# Altium schematic sheet LoRaSnow_big.SchDoc
size A3; Date: Date; CompanyName: HESSO; Engineer: Name; Address1: Route du Rawyl 47; Address2: 1950 Sion; Address3: Switzerland; ProjectName: Project Name
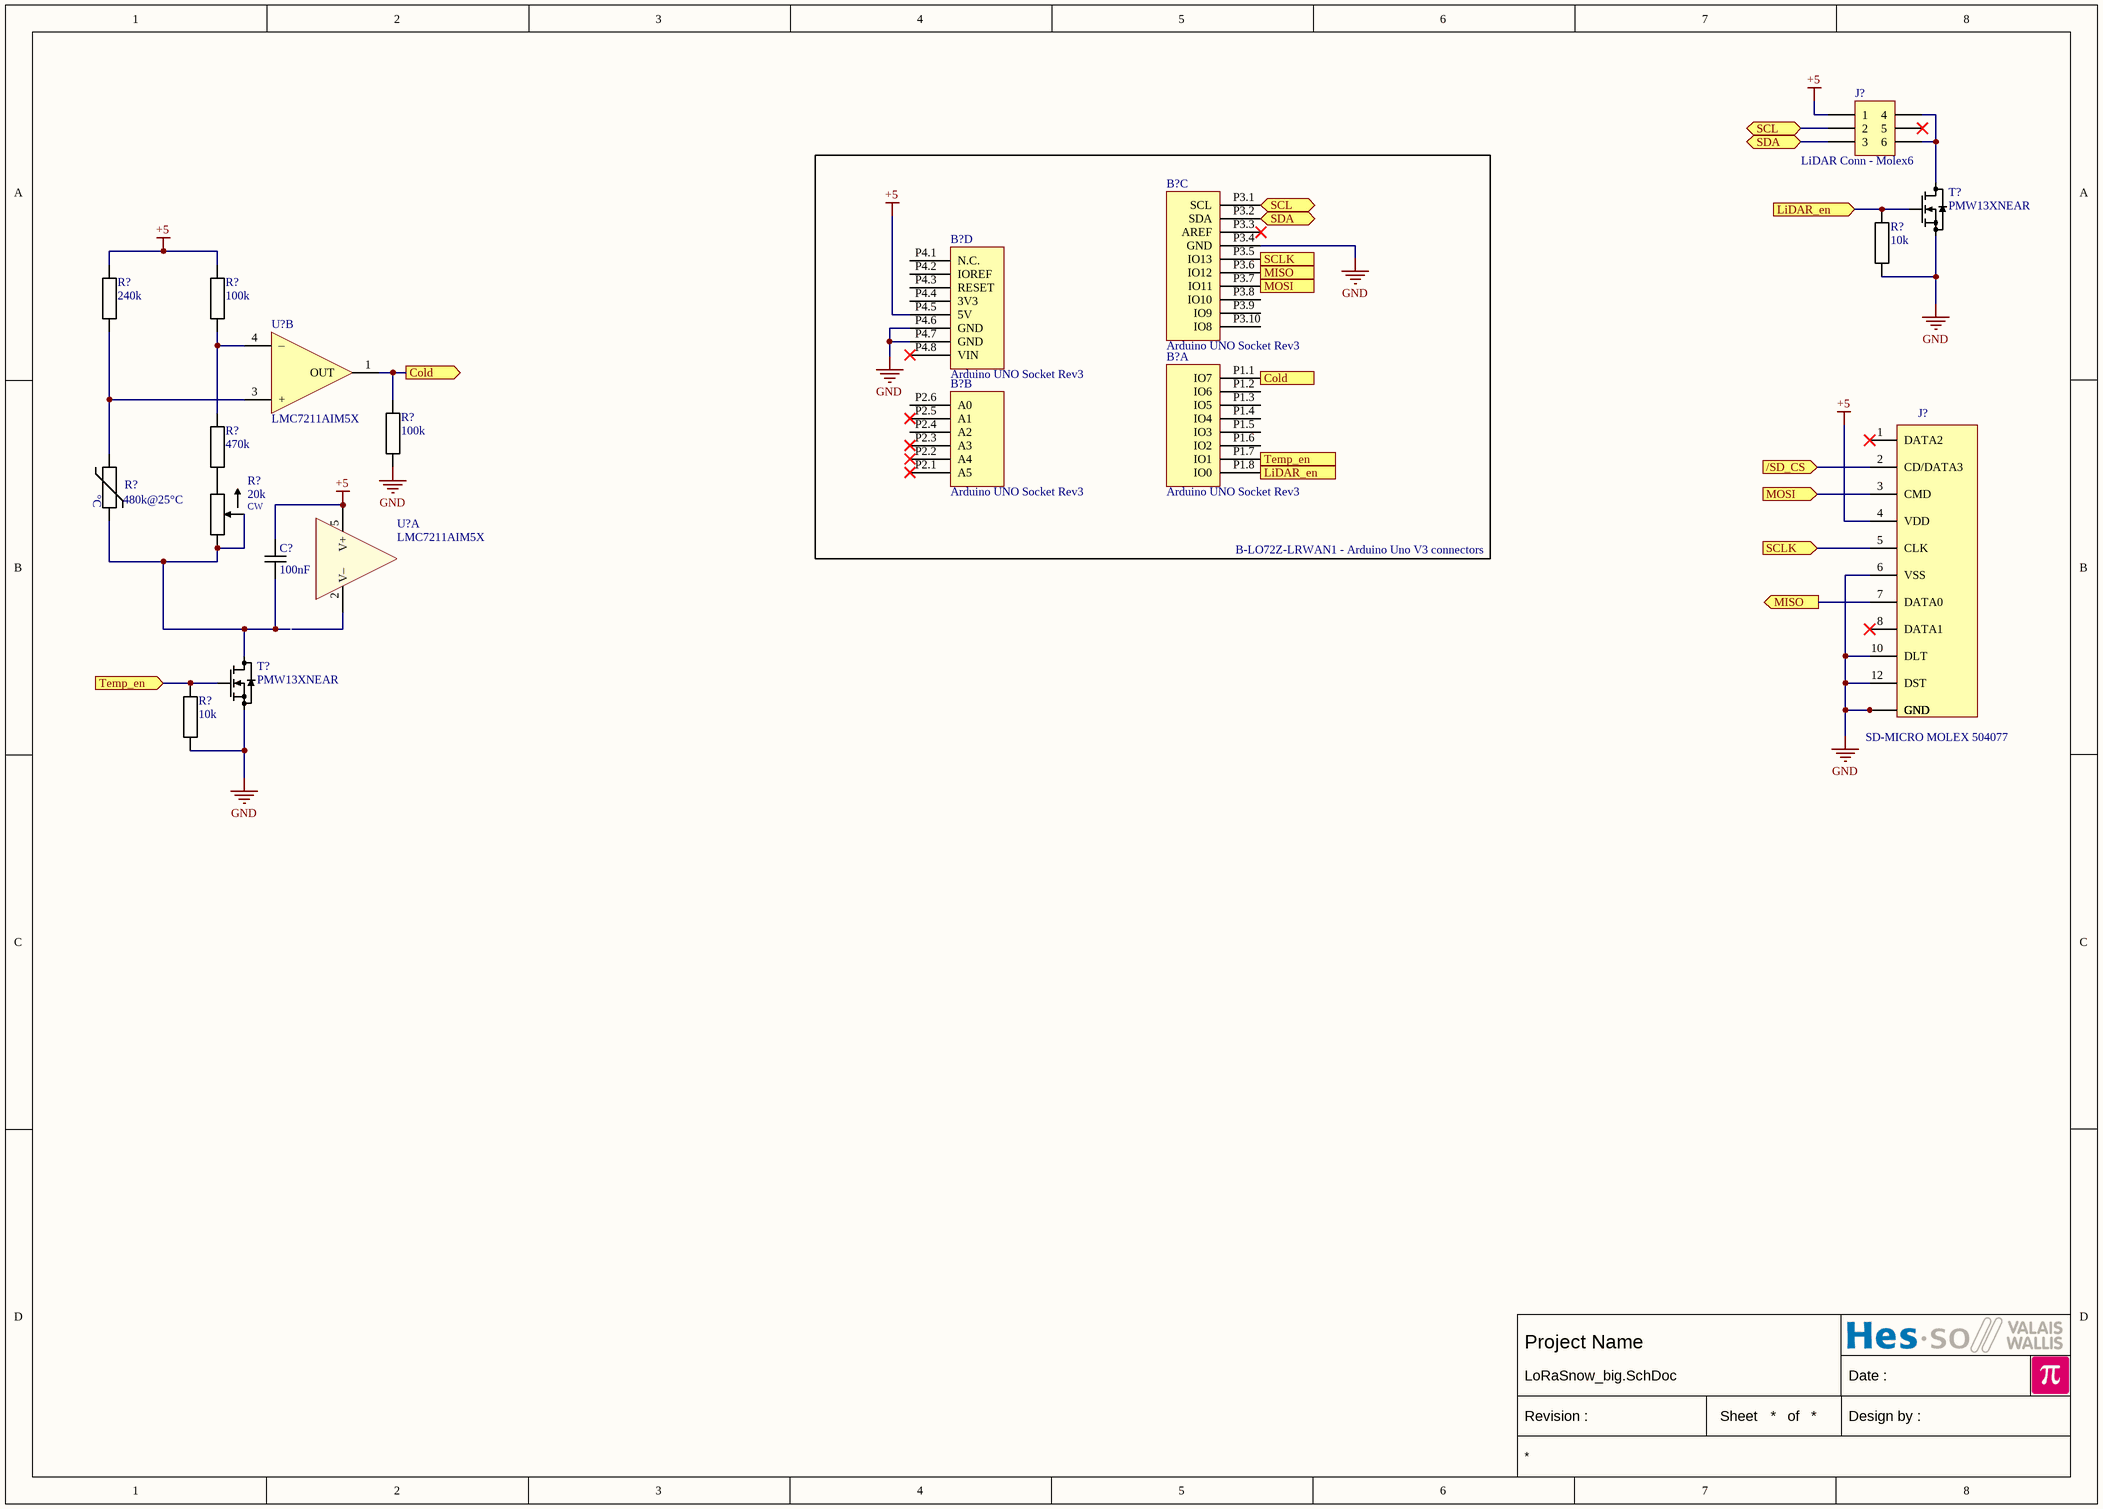
[diagram p0: LoRaSnow_big.SchDoc]

## Parts
(Parts that share a designator on the sheet are numbered #1, #2 ... from top to bottom, then left to right.)
B?#1  Arduino UNO Socket Rev3  [Arduino Uno Socket Rev3]  (part C of 4)
B?#2  Arduino UNO Socket Rev3  [Arduino Uno Socket Rev3]  (part D of 4)
B?#3  Arduino UNO Socket Rev3  [Arduino Uno Socket Rev3]  (part A of 4)
B?#4  Arduino UNO Socket Rev3  [Arduino Uno Socket Rev3]  (part B of 4)
C?  100nF  [CAPACITOR 0510 REFLOW]
J?#1  LiDAR Conn - Molex6  [MOLEX 43045-0600]
J?#2  SD-MICRO MOLEX 504077  [SD MICRO MOLEX 504077]
R?#1  10k  [RESISTOR 1608 REFLOW]
R?#2  240k  [RESISTOR 1608 REFLOW]
R?#3  100k  [RESISTOR 1608 REFLOW]
R?#4  480k@25°C  [RESISTOR 1608 REFLOW]
R?#5  100k  [RESISTOR 1608 REFLOW]
R?#6  20k  [Trimmer BOURNS 3266W]
R?#7  470k  [RESISTOR 1608 REFLOW]
R?#8  10k  [RESISTOR 1608 REFLOW]
T?#1  PMW13XNEAR  [SOT23 P0.95 C1.6x3.0 H1.3]
T?#2  PMW13XNEAR  [SOT23 P0.95 C1.6x3.0 H1.3]
U?#1  LMC7211AIM5X  [SOT23-5 P0.95 C1.6x3.0 H1.3]  (part B of 2)
U?#2  LMC7211AIM5X  [SOT23-5 P0.95 C1.6x3.0 H1.3]  (part A of 2)

## Blocks framed on the sheet
B-LO72Z-LRWAN1 - Arduino Uno V3 connectors: B?#1-B?#4

## Ports
/SD_CS (in), Cold (in), Cold (out), LiDAR_en (in), LiDAR_en (out), MISO (in), MISO (out), MOSI (in), MOSI (out), SCL (bidir), SCLK (in), SCLK (out), SDA (bidir), Temp_en (in), Temp_en (out)

## Nets
+5: B?#2.P4.5(5V) C?.2 J?#1.1 J?#2.4(VDD) R?#2.2 R?#3.2 U?#2.5(V+)
GND: B?#1.P3.4(GND) B?#2.P4.6(GND) B?#2.P4.7(GND) J?#2.6(VSS) J?#2.9(GND) J?#2.10(DLT) J?#2.11(GND) J?#2.12(DST) J?#2.13(GND) J?#2.14(GND) J?#2.15(GND) J?#2.16(GND) R?#1.1 R?#5.1 R?#8.1 T?#1.2(S) T?#2.2(S)
/SD_CS: J?#2.2(CD/DATA3) ; port /SD_CS
Cold: B?#3.P1.1(IO7) R?#5.2 U?#1.1(OUT) ; port Cold
LiDAR_en: B?#3.P1.8(IO0) R?#1.2 T?#1.1(G) ; port LiDAR_en
MISO: B?#1.P3.6(IO12) J?#2.7(DATA0) ; port MISO
MOSI: B?#1.P3.7(IO11) J?#2.3(CMD) ; port MOSI
SCL: B?#1.P3.1(SCL) J?#1.2 ; port SCL
SCLK: B?#1.P3.5(IO13) J?#2.5(CLK) ; port SCLK
SDA: B?#1.P3.2(SDA) J?#1.3 ; port SDA
Temp_en: B?#3.P1.7(IO1) R?#8.2 T?#2.1(G) ; port Temp_en
NetC?_1: C?.1 R?#4.2 R?#6.1 R?#6.2(WIPER) T?#2.3(D)
NetJ?#1_4: J?#1.4 J?#1.6 T?#1.3(D)
NetR?#2_1: R?#2.1 R?#4.1 U?#1.3(+)
NetR?#3_1: R?#3.1 R?#7.2 U?#1.4(–)
NetR?#6_3: R?#6.3 R?#7.1

Not connected (* = marked no-connect by the designer): B?#1 P3.3(AREF)* P3.8(IO10) P3.9(IO9) P3.10(IO8); B?#2 P4.1(N.C.) P4.2(IOREF) P4.3(RESET) P4.4(3V3) P4.8(VIN)*; B?#3 P1.2(IO6) P1.3(IO5) P1.4(IO4) P1.5(IO3) P1.6(IO2); B?#4 P2.1(A5)* P2.2(A4)* P2.3(A3)* P2.4(A2) P2.5(A1)* P2.6(A0); J?#1 5*; J?#2 1(DATA2)* 8(DATA1)*; U?#2 2(V–)

## Notes on the sheet
- Date :
- Revision :
- Sheet
- of
- Design by :
- (in symbol Thermal Resistor) °C

## Library data of the parts
B?#1-B?#4 = Arduino UNO Socket Rev3: Microcontroller board based on the ATmega328P Rev3; Value: Arduino UNO Socket Rev3
C? = Capacitor: Value: 100nF
J?#1 = MOLEX 43045-0600: Micro-Fit 3.0 Right-Angle Header, 3.00mm Pitch, Dual Row, 6 Circuits
J?#2 = SD-MICRO MOLEX 504077: SD Card Micro
R?#1-R?#3 R?#5 R?#7 R?#8 = Resistor
  R?#1 R?#8: Value: 10k
  R?#2: Value: 240k
  R?#3 R?#5: Value: 100k
  R?#7: Value: 470k
R?#4 = Thermal Resistor: Value: 480k@25°C
R?#6 = Trimmer: Value: 20k; CW: CW
T?#1 T?#2 = MOS-N SOT23 G-S-D: Generic MOS-N; Value: PMW13XNEAR
U?#1 U?#2 = COMPARATOR SINGLE SOT23-5: Generic Single Comparator 5pins 1OUT/2-V/3+IN/4-IN/5+V; Value: LMC7211AIM5X